# EAGLE design I2CRJ45 (EAGLE 9.4.2)
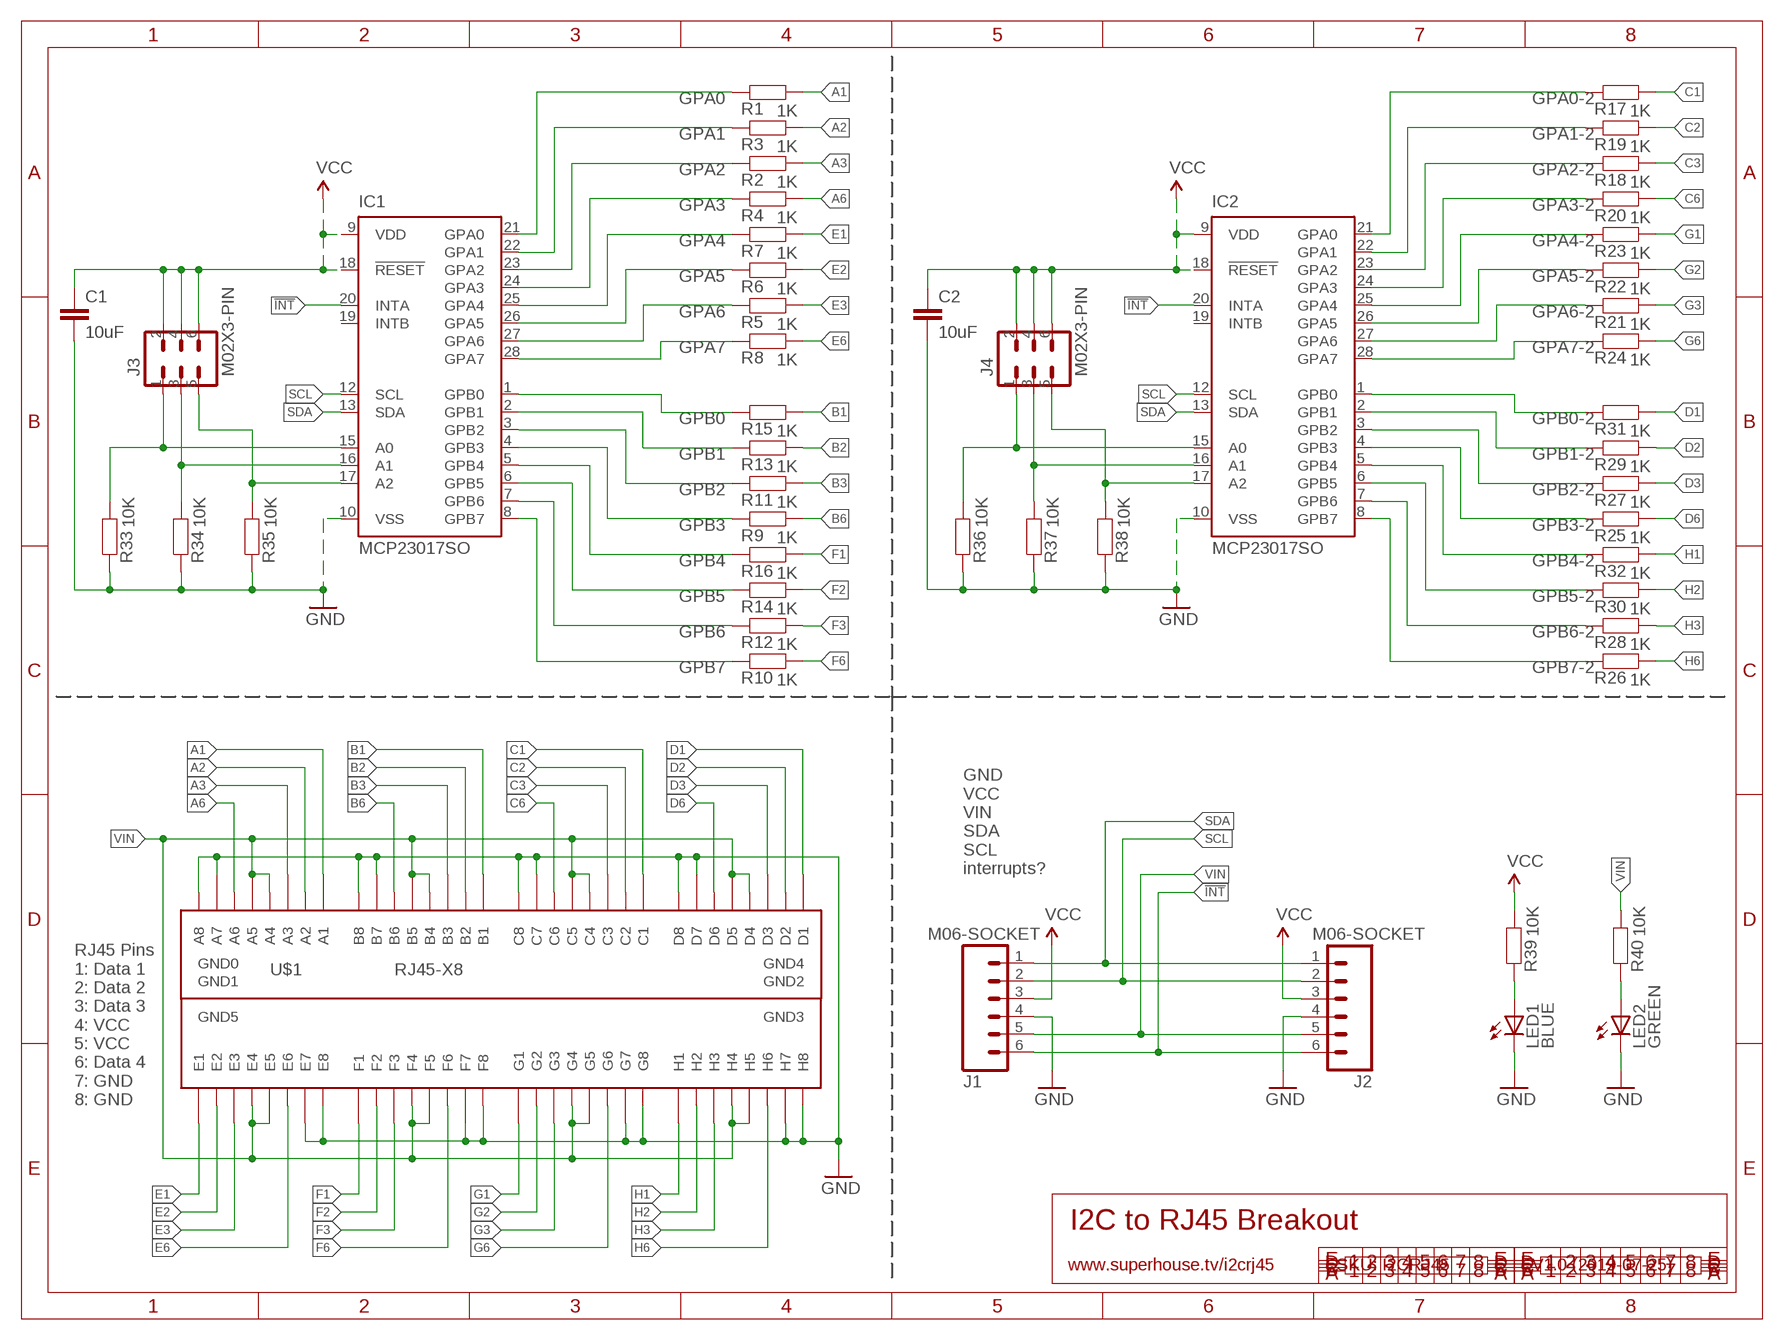
[diagram p0: schematic, sheet 1]

## Parts
C1  10uF  CAP0805  [C0805]
C2  10uF  CAP0805  [C0805]
IC1  MCP23017SO  [SO28W]
IC2  MCP23017SO  [SO28W]
J1  M06-SOCKET  [1X06-S]
J2  M06-SOCKET  [1X06-S]
J3  M02X3-PIN  [2X03-P]
J4  M02X3-PIN  [2X03-P]
LED1  BLUE  LED0603  [LED-0603]
LED2  GREEN  LED0603  [LED-0603]
R1  1K  RESISTOR0603  [R0603]
R2  1K  RESISTOR0603  [R0603]
R3  1K  RESISTOR0603  [R0603]
R4  1K  RESISTOR0603  [R0603]
R5  1K  RESISTOR0603  [R0603]
R6  1K  RESISTOR0603  [R0603]
R7  1K  RESISTOR0603  [R0603]
R8  1K  RESISTOR0603  [R0603]
R9  1K  RESISTOR0603  [R0603]
R10  1K  RESISTOR0603  [R0603]
R11  1K  RESISTOR0603  [R0603]
R12  1K  RESISTOR0603  [R0603]
R13  1K  RESISTOR0603  [R0603]
R14  1K  RESISTOR0603  [R0603]
R15  1K  RESISTOR0603  [R0603]
R16  1K  RESISTOR0603  [R0603]
R17  1K  RESISTOR0603  [R0603]
R18  1K  RESISTOR0603  [R0603]
R19  1K  RESISTOR0603  [R0603]
R20  1K  RESISTOR0603  [R0603]
R21  1K  RESISTOR0603  [R0603]
R22  1K  RESISTOR0603  [R0603]
R23  1K  RESISTOR0603  [R0603]
R24  1K  RESISTOR0603  [R0603]
R25  1K  RESISTOR0603  [R0603]
R26  1K  RESISTOR0603  [R0603]
R27  1K  RESISTOR0603  [R0603]
R28  1K  RESISTOR0603  [R0603]
R29  1K  RESISTOR0603  [R0603]
R30  1K  RESISTOR0603  [R0603]
R31  1K  RESISTOR0603  [R0603]
R32  1K  RESISTOR0603  [R0603]
R33  10K  RESISTOR0603  [R0603]
R34  10K  RESISTOR0603  [R0603]
R35  10K  RESISTOR0603  [R0603]
R36  10K  RESISTOR0603  [R0603]
R37  10K  RESISTOR0603  [R0603]
R38  10K  RESISTOR0603  [R0603]
R39  10K  RESISTOR0603  [R0603]
R40  10K  RESISTOR0603  [R0603]
U$1  RJ45-X8  [RJ45-2X4]

## Nets
!INT: IC1.20(INTA) IC2.20(INTA) J1.6 J2.6
A1: R1.2 U$1.A1
A2: R3.2 U$1.A2
A3: R2.2 U$1.A3
A6: R4.2 U$1.A6
B1: R15.2 U$1.B1
B2: R13.2 U$1.B2
B3: R11.2 U$1.B3
B6: R9.2 U$1.B6
C1: R17.2 U$1.C1
C2: R19.2 U$1.C2
C3: R18.2 U$1.C3
C6: R20.2 U$1.C6
D1: R31.2 U$1.D1
D2: R29.2 U$1.D2
D3: R27.2 U$1.D3
D6: R25.2 U$1.D6
E1: R7.2 U$1.E1
E2: R6.2 U$1.E2
E3: R5.2 U$1.E3
E6: R8.2 U$1.E6
F1: R16.2 U$1.F1
F2: R14.2 U$1.F2
F3: R12.2 U$1.F3
F6: R10.2 U$1.F6
G1: R23.2 U$1.G1
G2: R22.2 U$1.G2
G3: R21.2 U$1.G3
G6: R24.2 U$1.G6
GND: C1.2 C2.2 IC1.10(VSS) IC2.10(VSS) J1.4 J2.4 LED1.C LED2.C R33.1 R34.1 R35.1 R36.1 R37.1 R38.1 U$1.A7 U$1.A8 U$1.B7 U$1.B8 U$1.C7 U$1.C8 U$1.D7 U$1.D8 U$1.E7 U$1.E8 U$1.F7 U$1.F8 U$1.G7 U$1.G8 U$1.H7 U$1.H8
GPA0: IC1.21(GPA0) R1.1
GPA0-2: IC2.21(GPA0) R17.1
GPA1: IC1.22(GPA1) R3.1
GPA1-2: IC2.22(GPA1) R19.1
GPA2: IC1.23(GPA2) R2.1
GPA2-2: IC2.23(GPA2) R18.1
GPA3: IC1.24(GPA3) R4.1
GPA3-2: IC2.24(GPA3) R20.1
GPA4: IC1.25(GPA4) R7.1
GPA4-2: IC2.25(GPA4) R23.1
GPA5: IC1.26(GPA5) R6.1
GPA5-2: IC2.26(GPA5) R22.1
GPA6: IC1.27(GPA6) R5.1
GPA6-2: IC2.27(GPA6) R21.1
GPA7: IC1.28(GPA7) R8.1
GPA7-2: IC2.28(GPA7) R24.1
GPB0: IC1.1(GPB0) R15.1
GPB0-2: IC2.1(GPB0) R31.1
GPB1: IC1.2(GPB1) R13.1
GPB1-2: IC2.2(GPB1) R29.1
GPB2: IC1.3(GPB2) R11.1
GPB2-2: IC2.3(GPB2) R27.1
GPB3: IC1.4(GPB3) R9.1
GPB3-2: IC2.4(GPB3) R25.1
GPB4: IC1.5(GPB4) R16.1
GPB4-2: IC2.5(GPB4) R32.1
GPB5: IC1.6(GPB5) R14.1
GPB5-2: IC2.6(GPB5) R30.1
GPB6: IC1.7(GPB6) R12.1
GPB6-2: IC2.7(GPB6) R28.1
GPB7: IC1.8(GPB7) R10.1
GPB7-2: IC2.8(GPB7) R26.1
H1: R32.2 U$1.H1
H2: R30.2 U$1.H2
H3: R28.2 U$1.H3
H6: R26.2 U$1.H6
N$1: IC2.16(A1) J4.3 R37.2
N$2: IC1.17(A2) J3.5 R35.2
N$3: IC1.16(A1) J3.3 R34.2
N$4: IC1.15(A0) J3.1 R33.2
N$5: IC2.15(A0) J4.1 R36.2
N$6: IC2.17(A2) J4.5 R38.2
N$7: LED1.A R39.1
N$8: LED2.A R40.1
SCL: IC1.12(SCL) IC2.12(SCL) J1.2 J2.2
SDA: IC1.13(SDA) IC2.13(SDA) J1.1 J2.1
VCC: C1.1 C2.1 IC1.9(VDD) IC1.18(!RESET) IC2.9(VDD) IC2.18(!RESET) J1.3 J2.3 J3.2 J3.4 J3.6 J4.2 J4.4 J4.6 R39.2
VIN: J1.5 J2.5 R40.2 U$1.A4 U$1.A5 U$1.B4 U$1.B5 U$1.C4 U$1.C5 U$1.D4 U$1.D5 U$1.E4 U$1.E5 U$1.F4 U$1.F5 U$1.G4 U$1.G5 U$1.H4 U$1.H5
Unconnected: IC1.19(INTB) IC2.19(INTB)

## Notes on the sheet
- GND
  VCC
  VIN
  SDA
  SCL
  interrupts?
- RJ45 Pins
  1: Data 1
  2: Data 2
  3: Data 3
  4: VCC
  5: VCC
  6: Data 4
  7: GND
  8: GND
- I2C to RJ45 Breakout
- www.superhouse.tv/i2crj45 | SKU: I2CRJ45 | V1.0 (2019-07-25)

## Power pins joined to a net without a drawn wire
GND0: U$1.GND0
GND1: U$1.GND1
GND2: U$1.GND2
GND3: U$1.GND3
GND4: U$1.GND4
GND5: U$1.GND5

## Library data of the parts
C1 C2 = SuperHouse-DiscreteSemi:CAP: Capacitor Standard ceramic capacitor
IC1 IC2 = SuperHouse-ICs:MCP23017: http://ww1.microchip.com/downloads/en/DeviceDoc/21952a.pdf Source: http://ww1.microchip.com/downloads/en/DeviceDoc/21952a.pdf
J1 J2 = SuperHouse-Connectors:M06: 6-way header Standard 1x6 header, and screw terminal variations
J3 J4 = SuperHouse-Connectors:M02X3
LED1 LED2 = SuperHouse-LEDs:LED: LEDs Standard schematic elements and footprints for 5mm, 3mm, 1206, and 0603 sized LEDs. 5mm - Spark Fun Electronics SKU : COM-00529 (and others)
R1-R40 = SuperHouse-DiscreteSemi:RESISTOR: Resistor Standard resistors.
U$1 = SuperHouse-Connectors:RJ45-X8: 8-way RJ45 socket, PCB mount. 2 rows of 4.

## Board
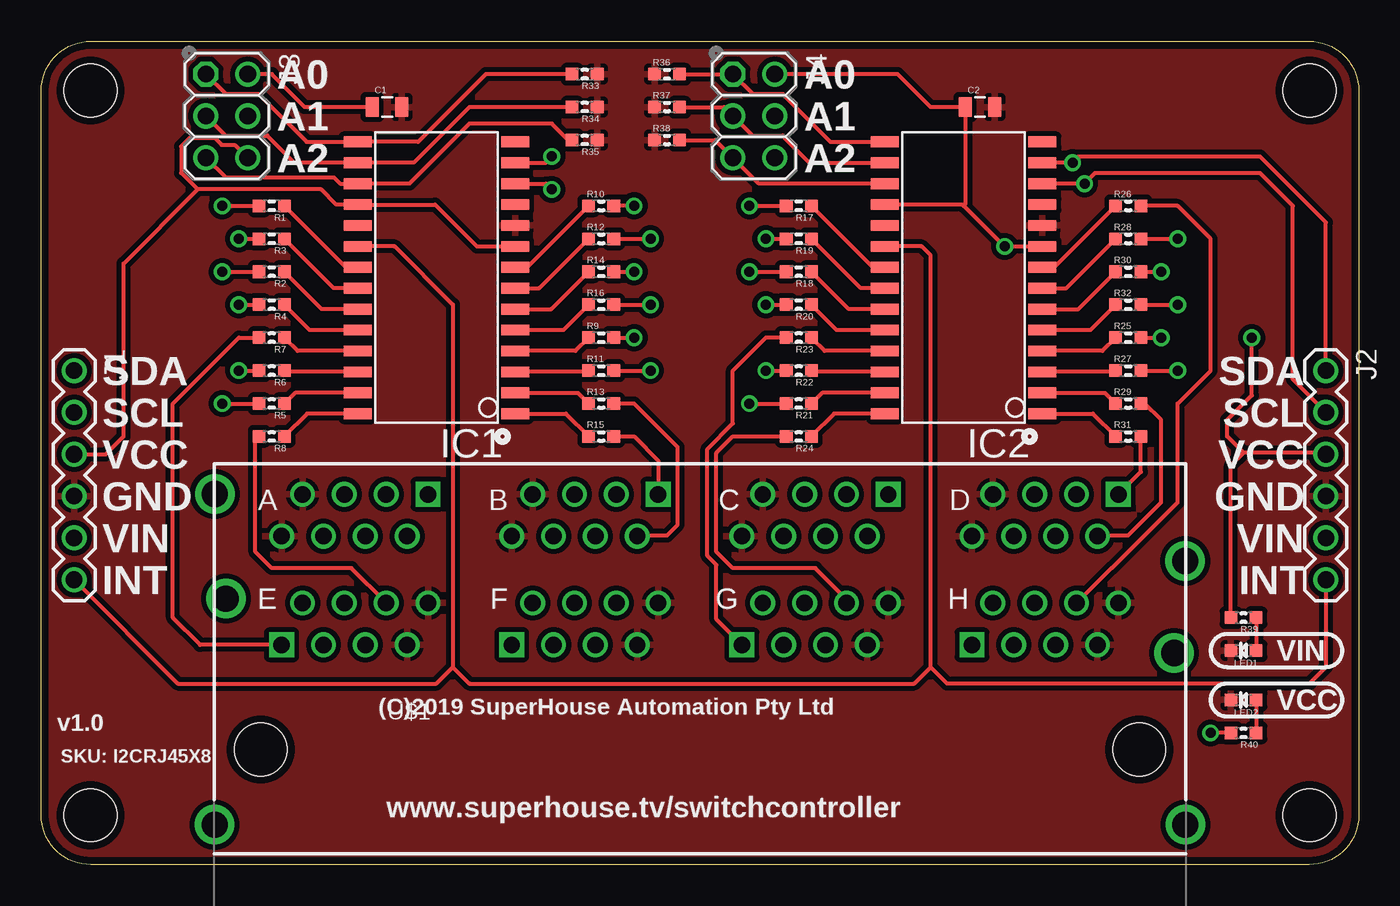
[diagram p1: board, top side]
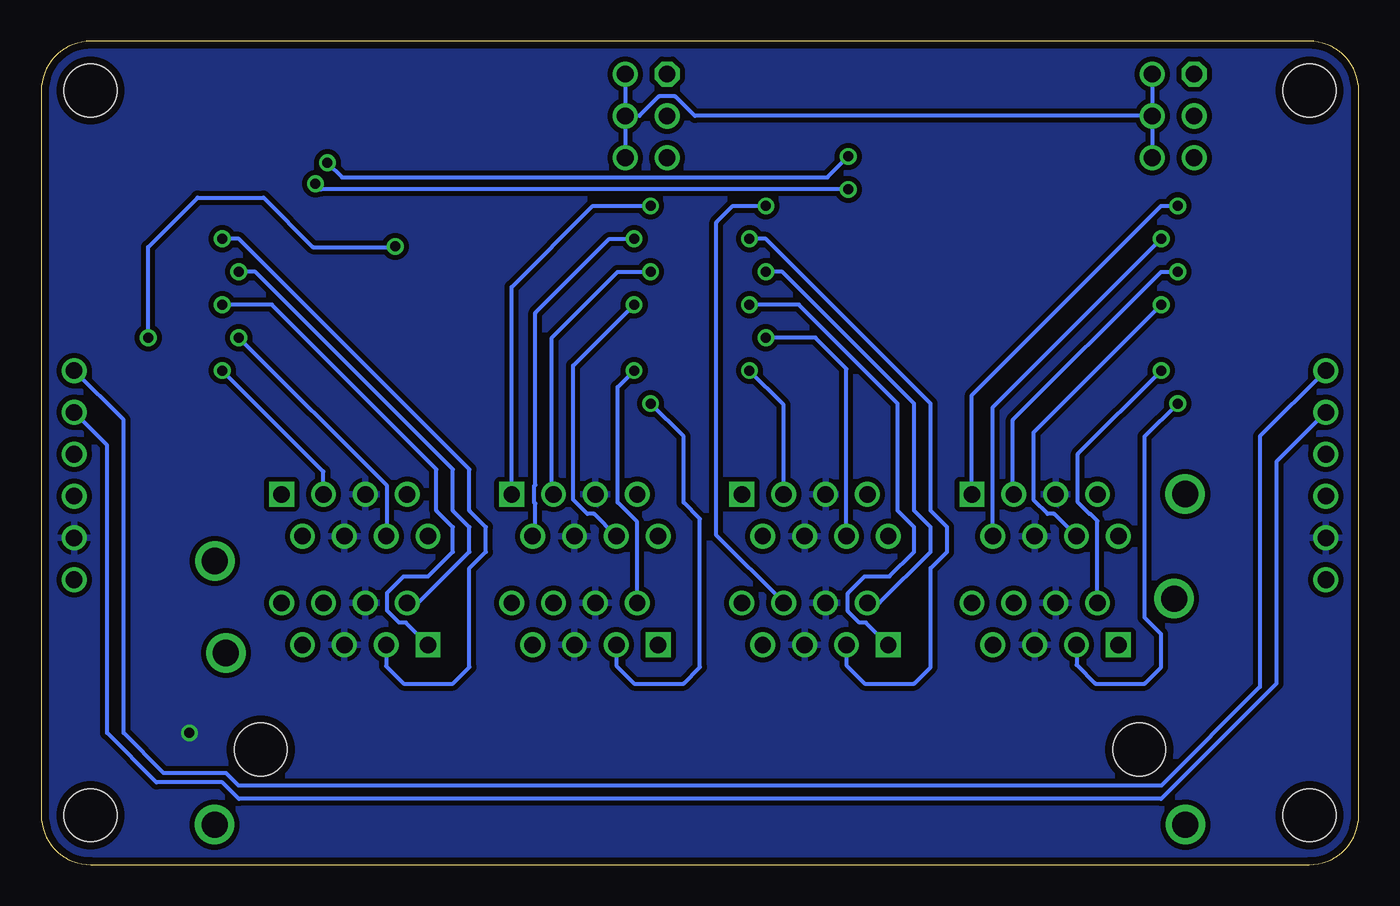
[diagram p2: board, bottom side, seen from below]

Size 80 x 50 mm. Coordinates in mm from the lower left corner, seen from the top.
Outline: 3,0 arc-90 0,3 0,47 arc-90 3,50 77,50 arc-90 80,47 80,3 arc-90 77,0 3,0
Copper layers (1*16): Top 0.035mm / dielectric 1.5mm / Bottom 0.035mm
Design rules "default *": minimum track width 10mil, minimum drill 24mil, track to track 12mil, track to pad 12mil, pad to pad 12mil, via to via 12mil, smd to smd 8mil, copper to edge 18mil, drill to drill 8mil, minimum pad ring 10mil, minimum via ring 8mil, stop-mask expansion 4mil, vias tented up to drill 0mil, thermal gap 10mil
Holes 3.2 mm at 3,3 77,3 77,47 3,47

### Footprints (pad centres in the part's own frame; a part is rotated, then mirrored left to right if it is on the bottom)
C0805 = smd 0.8 x 1.2: 1 -0.9,0; 2 0.9,0
SO28W = smd 0.65 x 1.7: 1 -7.62,-4.78; 2 -6.35,-4.78; 3 -5.08,-4.78; 4 -3.81,-4.78; 5 -2.54,-4.78; 6 -1.27,-4.78; 7 0,-4.78; 8 1.27,-4.78; 9 2.54,-4.78; 10 3.81,-4.78; 11 5.08,-4.78; 12 6.35,-4.78; 13 7.62,-4.78; 14 8.89,-4.78; 15 8.89,4.78; 16 7.62,4.78; 17 6.35,4.78; 18 5.08,4.78; 19 3.81,4.78; 20 2.54,4.78; 21 1.27,4.78; 22 0,4.78; 23 -1.27,4.78; 24 -2.54,4.78; 25 -3.81,4.78; 26 -5.08,4.78; 27 -6.35,4.78; 28 -7.62,4.78
1X06-S = drill 1.016: 1 0,0; 2 2.54,0; 3 5.08,0; 4 7.62,0; 5 10.16,0; 6 12.7,0
2X03-P = drill 1.016 octagon: 1 0,0 | drill 1.016: 2 0,2.54; 3 2.54,0; 4 2.54,2.54; 5 5.08,0; 6 5.08,2.54
LED-0603 = smd 0.762 x 0.762: A -0.762,0; C 0.762,0
R0603 = smd 0.762 x 0.762: 1 -0.762,0; 2 0.762,0
RJ45-2X4 = drill 1 square: A1 -16.51,15.49; B1 -2.54,15.49; C1 11.43,15.49; D1 25.4,15.49; E1 -25.4,6.35; F1 -11.43,6.35; G1 2.54,6.35; H1 16.51,6.35 | drill 1: A2 -17.78,12.95; A3 -19.05,15.49; A4 -20.32,12.95; A5 -21.59,15.49; A6 -22.86,12.95; A7 -24.13,15.49; A8 -25.4,12.95; B2 -3.81,12.95; B3 -5.08,15.49; B4 -6.35,12.95; B5 -7.62,15.49; B6 -8.89,12.95; B7 -10.16,15.49; B8 -11.43,12.95; C2 10.16,12.95; C3 8.89,15.49; C4 7.62,12.95; C5 6.35,15.49; C6 5.08,12.95; C7 3.81,15.49; C8 2.54,12.95; D2 24.13,12.95; D3 22.86,15.49; D4 21.59,12.95; D5 20.32,15.49; D6 19.05,12.95; D7 17.78,15.49; D8 16.51,12.95; E2 -24.13,8.89; E3 -22.86,6.35; E4 -21.59,8.89; E5 -20.32,6.35; E6 -19.05,8.89; E7 -17.78,6.35; E8 -16.51,8.89; F2 -10.16,8.89; F3 -8.89,6.35; F4 -7.62,8.89; F5 -6.35,6.35; F6 -5.08,8.89; F7 -3.81,6.35; F8 -2.54,8.89; G2 3.81,8.89; G3 5.08,6.35; G4 6.35,8.89; G5 7.62,6.35; G6 8.89,8.89; G7 10.16,6.35; G8 11.43,8.89; H2 17.78,8.89; H3 19.05,6.35; H4 20.32,8.89; H5 21.59,6.35; H6 22.86,8.89; H7 24.13,6.35; H8 25.4,8.89 | drill 1.6: GND0 29.464,-4.572; GND1 28.79,5.85; GND2 -29.46,15.5; GND3 -28.79,9.15; GND4 -29.464,-4.572; GND5 29.46,11.43 | hole 3.2: 26.67,0; -26.67,0

### Placement (x,y rotation side)
C1  21,46 0 top
C2  57,46 0 top
IC1  24,35 90 top
IC2  56,35 90 top
J1  2,30 270 top
J2  78,30 270 top
J3  10,48 270 top
J4  42,48 270 top
LED1  73,13 180 top
LED2  73,10 180 top
R1  14,40 180 top
R2  14,36 180 top
R3  14,38 180 top
R4  14,34 180 top
R5  14,28 180 top
R6  14,30 180 top
R7  14,32 180 top
R8  14,26 180 top
R9  34,32 0 top
R10  34,40 0 top
R11  34,30 0 top
R12  34,38 0 top
R13  34,28 0 top
R14  34,36 0 top
R15  34,26 0 top
R16  34,34 0 top
R17  46,40 180 top
R18  46,36 180 top
R19  46,38 180 top
R20  46,34 180 top
R21  46,28 180 top
R22  46,30 180 top
R23  46,32 180 top
R24  46,26 180 top
R25  66,32 0 top
R26  66,40 0 top
R27  66,30 0 top
R28  66,38 0 top
R29  66,28 0 top
R30  66,36 0 top
R31  66,26 0 top
R32  66,34 0 top
R33  33,48 180 top
R34  33,46 180 top
R35  33,44 180 top
R36  38,48 0 top
R37  38,46 0 top
R38  38,44 0 top
R39  73,15 180 top
R40  73,8 180 top
U$1  40,7 0 top

### Tracks (layer width: path | path; a pad name or v marks a point on that pad's centre or on a via)
!INT
  Top 0.254: J1.6 8.3,11 24,11 25,12 | 25,12 25,34 21.46,37.54 IC1.20 | 25,12 26,11 53,11 54,12 | IC2.20 53.46,37.54 54,37 54,12 | J2.6 78,12 77,11 55,11 54,12
A1  (via drill 0.61)
  Top 0.254: v11,40 R1.2
  Bottom 0.254: U$1.A1 23.49,28.51 12,40 v11,40
A2  (via drill 0.61)
  Top 0.254: v12,38 R3.2
  Bottom 0.254: U$1.A2 22.22,27.78 v12,38
A3  (via drill 0.61)
  Top 0.254: v11,36 R2.2
  Bottom 0.254: U$1.A3 21,22.54 21,27 12,36 v11,36
A6  (via drill 0.61)
  Top 0.254: v12,34 R4.2
  Bottom 0.254: U$1.A6 18.49,21.3 18.9,21.3 19.76,22.17 19.76,26.24 v12,34
B1
  Top 0.254: R15.2 36,26 37.46,24.54 U$1.B1
B2
  Top 0.254: U$1.B2 36.24,20 38,20 38.65,20.65 38.65,25.35 36,28 R13.2
B3  (via drill 0.61)
  Top 0.254: R11.2 v37,30
  Bottom 0.254: U$1.B3 34.92,27.92 v37,30
B6  (via drill 0.61)
  Top 0.254: R9.2 v36,32
  Bottom 0.254: U$1.B6 31.11,30.11 33,32 v36,32
C1  (via drill 0.61)
  Top 0.254: v43,40 R17.2
  Bottom 0.254: U$1.C1 51.43,35.07 46.5,40 v43,40
C2  (via drill 0.61)
  Top 0.254: v44,38 R19.2
  Bottom 0.254: U$1.C2 50,20.11 50,21.92 50.08,22 50.08,22.98 50,23.06 50,33.5 45.5,38 v44,38
C3  (via drill 0.61)
  Top 0.254: v43,36 R18.2
  Bottom 0.254: U$1.C3 49,22.6 49,32 45,36 v43,36
C6  (via drill 0.61)
  Top 0.254: v44,34 R20.2
  Bottom 0.254: U$1.C6 46.43,21.3 46.84,21.3 47.7,22.17 47.7,30.3 v44,34
D1
  Top 0.254: U$1.D1 66.76,23.85 R31.2
D2
  Top 0.254: U$1.D2 64.18,20 66,20 68,22 68,27 67,28 R29.2
D3  (via drill 0.61)
  Top 0.254: R27.2 v69,30
  Bottom 0.254: U$1.D3 62.86,23.86 v69,30
D6  (via drill 0.61)
  Top 0.254: R25.2 v68,32
  Bottom 0.254: U$1.D6 59,20 59,23 v68,32
E1
  Top 0.254: U$1.E1 9.65,13.35 8,15 8,28 12,32 R7.2
E2  (via drill 0.61)
  Top 0.254: v12,30 R6.2
  Bottom 0.254: U$1.E2 15.87,20.87 16.3,21.3 16.36,21.3 17.06,22 17.06,24.94 v12,30
E3  (via drill 0.61)
  Top 0.254: v11,28 R5.2
  Bottom 0.254: U$1.E3 17.14,12.14 16,11 13,11 12,12 12,14 13,15 13,26 v11,28
E6
  Top 0.254: U$1.E6 18.84,18 14,18 13,19 13,25.76 R8.2
F1  (via drill 0.61)
  Top 0.254: R16.2 v37,34
  Bottom 0.254: U$1.F1 29.92,14.7 30.33,14.7 31.03,15.4 31.03,16.47 30,17.5 28.5,17.5 27,19 27,20.5 28,21.5 28,28 34,34 v37,34
F2  (via drill 0.61)
  Top 0.254: R14.2 v36,36
  Bottom 0.254: U$1.F2 29.11,15.89 26,19 26,20.5 27,21.5 27,28 35,36 v36,36
F3  (via drill 0.61)
  Top 0.254: R12.2 v37,38
  Bottom 0.254: U$1.F3 31.11,12.11 30,11 27,11 26,12 26,18 25,19 25,20.5 26,21.5 26,28 36,38 v37,38
F6  (via drill 0.61)
  Top 0.254: v36,40 R10.2
  Bottom 0.254: U$1.F6 34.92,15.92 39,20 39,39 38,40 v36,40
G1
  Top 0.254: R23.2 44,32 42,30 42,26.79 40.44,25.23 40.44,18.77 41,18.21 41,14.89 U$1.G1
G2  (via drill 0.61)
  Top 0.254: v44,30 R22.2
  Bottom 0.254: U$1.G2 43.81,20.81 45,22 45,29 v44,30
G3  (via drill 0.61)
  Top 0.254: v43,28 R21.2
  Bottom 0.254: U$1.G3 45.08,12.08 44,11 41,11 40,12 40,21 41,22 41,26 v43,28
G6
  Top 0.254: U$1.G6 48.89,16.11 47,18 42,18 41,19 41,25 42,26 R24.2
GND
  pour Top: 77,0 arc90 80,3 80,47 arc90 77,50 3,50 arc90 0,47 0,3 arc90 3,0
GPA0
  Top 0.254: IC1.21 18.49,36.27 R1.1
GPA0-2
  Top 0.254: IC2.21 50.49,36.27 R17.1
GPA1
  Top 0.254: IC1.22 17.76,35 R3.1
GPA1-2
  Top 0.254: IC2.22 49.76,35 R19.1
GPA2
  Top 0.254: IC1.23 17.03,33.73 R2.1
GPA2-2
  Top 0.254: IC2.23 49.03,33.73 R18.1
GPA3
  Top 0.254: R4.1 16.3,32.46 IC1.24
GPA3-2
  Top 0.254: R20.1 48.3,32.46 IC2.24
GPA4
  Top 0.254: R7.1 15.57,31.19 IC1.25
GPA4-2
  Top 0.254: R23.1 47.57,31.19 IC2.25
GPA5
  Top 0.254: IC1.26 14.84,29.92 R6.1
GPA5-2
  Top 0.254: IC2.26 46.84,29.92 R22.1
GPA6
  Top 0.254: IC1.27 15.41,28.65 R5.1
GPA6-2
  Top 0.254: IC2.27 47.41,28.65 R21.1
GPA7
  Top 0.254: IC1.28 16.14,27.38 R8.1
GPA7-2
  Top 0.254: IC2.28 48.14,27.38 R24.1
GPB0
  Top 0.254: IC1.1 31.86,27.38 R15.1
GPB0-2
  Top 0.254: IC2.1 63.86,27.38 R31.1
GPB1
  Top 0.254: IC1.2 32.59,28.65 R13.1
GPB1-2
  Top 0.254: IC2.2 64.59,28.65 R29.1
GPB2
  Top 0.254: R11.1 33.16,29.92 IC1.3
GPB2-2
  Top 0.254: R27.1 65.16,29.92 IC2.3
GPB3
  Top 0.254: R9.1 32.43,31.19 IC1.4
GPB3-2
  Top 0.254: R25.1 64.43,31.19 IC2.4
GPB4
  Top 0.254: R16.1 31.7,32.46 IC1.5
GPB4-2
  Top 0.254: R32.1 63.7,32.46 IC2.5
GPB5
  Top 0.254: IC1.6 30.97,33.73 R14.1
GPB5-2
  Top 0.254: IC2.6 62.97,33.73 R30.1
GPB6
  Top 0.254: IC1.7 30.24,35 R12.1
GPB6-2
  Top 0.254: IC2.7 62.24,35 R28.1
GPB7
  Top 0.254: IC1.8 29.51,36.27 R10.1
GPB7-2
  Top 0.254: IC2.8 61.51,36.27 R26.1
H1  (via drill 0.61)
  Top 0.254: R32.2 v69,34
  Bottom 0.254: U$1.H1 57.86,14.7 58.27,14.7 59,15.43 59,16.5 58,17.5 56.5,17.5 55,19 55,20.5 56,21.5 56,24 66,34 v69,34
H2  (via drill 0.61)
  Top 0.254: R30.2 v68,36
  Bottom 0.254: U$1.H2 57.11,15.89 54,19 54,20.5 55,21.5 55,24 67,36 v68,36
H3  (via drill 0.61)
  Top 0.254: R28.2 v69,38
  Bottom 0.254: U$1.H3 59.05,12.05 58,11 55,11 54,12 54,18 53,19 53,20.5 54,21.5 54,24 68,38 v69,38
H6
  Top 0.254: U$1.H6 64.97,18 65,18 69,22 69,28 71,30 71,38 69,40 R26.2
N$1
  Top 0.254: 45,44.27 43.19,44.27 J4.3 41.46,46 R37.2 | 45,44.27 45.03,44.27 | 45,44.27 46.65,42.62 IC2.16
N$2
  Top 0.254: R35.2 32,44 31,45 26,45 22.35,41.35 IC1.17 18.15,41.35 17.77,41.73 11.19,41.73 J3.5
N$3
  Top 0.254: J3.3 11.19,44.27 13.73,44.27 15.38,42.62 IC1.16 22.62,42.62 26,46 R34.2
N$4
  Top 0.254: J3.1 11.19,46.81 13.19,46.81 16.11,43.89 IC1.15 22.89,43.89 27,48 R33.2
N$5
  Top 0.254: 45,46.81 43.19,46.81 J4.1 R36.2 | 45,46.81 45.03,46.81 | 45,46.81 47.92,43.89 IC2.15
N$6
  Top 0.254: IC2.17 43.57,41.35 J4.5 40.92,44 R38.2
N$7
  Top 0.254: R39.1 LED1.A
N$8
  Top 0.254: LED2.A R40.1
SCL  (via drill 0.61)
  Top 0.254: J2.2 76,29.46 76,40 74,42 64,42 v63.35,41.35 IC2.12 | IC1.12 30.65,41.35 v31,41
  Bottom 0.254: v63.35,41.35 63,41 v31,41 | J1.2 5,24.46 5,11 12,4 68,4 69,5 73,5 76,8 76,25.46 J2.2
SDA  (via drill 0.61)
  Top 0.254: J2.1 78,39 74,43 63,43 v62.62,42.62 IC2.13 | IC1.13 30.62,42.62 v31,43
  Bottom 0.254: v31,43 32.27,41.73 61.73,41.73 v62.62,42.62 | J1.1 6,26 6,10.79 11.97,4.82 68.03,4.82 68.77,5.56 72.56,5.56 75,8 75,27 J2.1
VCC  (via drill 0.61)
  Top 0.254: IC1.9 26.46,37.54 23.92,40.08 IC1.18 17.92,40.08 17,41 9.5,41 | IC2.9 v58.5,37.54 58.46,37.54 56,40 | IC2.18 55.92,40.08 56,40 | 56,40 56.1,40.1 C2.1 54,46 52,48 J4.2 | R39.2 72.24,24.24 73,25 | 73,25 77.92,25 J2.3 | J3.2 14,48 16,46 C1.1 | J1.3 3.92,24.92 5,26 5,36.5 9.5,41 | J3.6 11.75,43.71 10.96,43.71 10.56,44.11 9,44.11 8.5,43.61 8.5,42 9.5,41 | 73,25 72,26 72,27 73.5,28.5 v73.5,32
  Bottom 0.254: J3.2 J3.4 | J3.4 J3.6 | J4.2 44.54,46 | 44.54,46 J4.4 J4.6 | 44.54,46 44,45.46 43.69,45.46 42.49,46.65 41.51,46.65 40.31,45.46 J3.4 | v58.5,37.54 58.5,37.5 63.5,37.5 66.5,40.5 70.5,40.5 73.5,37.5 v73.5,32
VIN  (via drill 0.61)
  Top 0.254: R40.2 v71,8
  pour Bottom: 77,0 arc90 80,3 80,47 arc90 77,50 3,50 arc90 0,47 0,3 arc90 3,0

### Text on the board
tPlace: A0 | A0 | A1 | A1 | A2 | A2 | SDA | SDA | SCL | SCL | VCC | VCC | GND | GND | VIN | VIN | INT | INT | VIN | VCC | (C)2019 SuperHouse Automation Pty Ltd | v1.0 | SKU: I2CRJ45X8 | www.superhouse.tv/switchcontroller